# Altium schematic sheet eth_ksz8567r_switch.SchDoc
size C
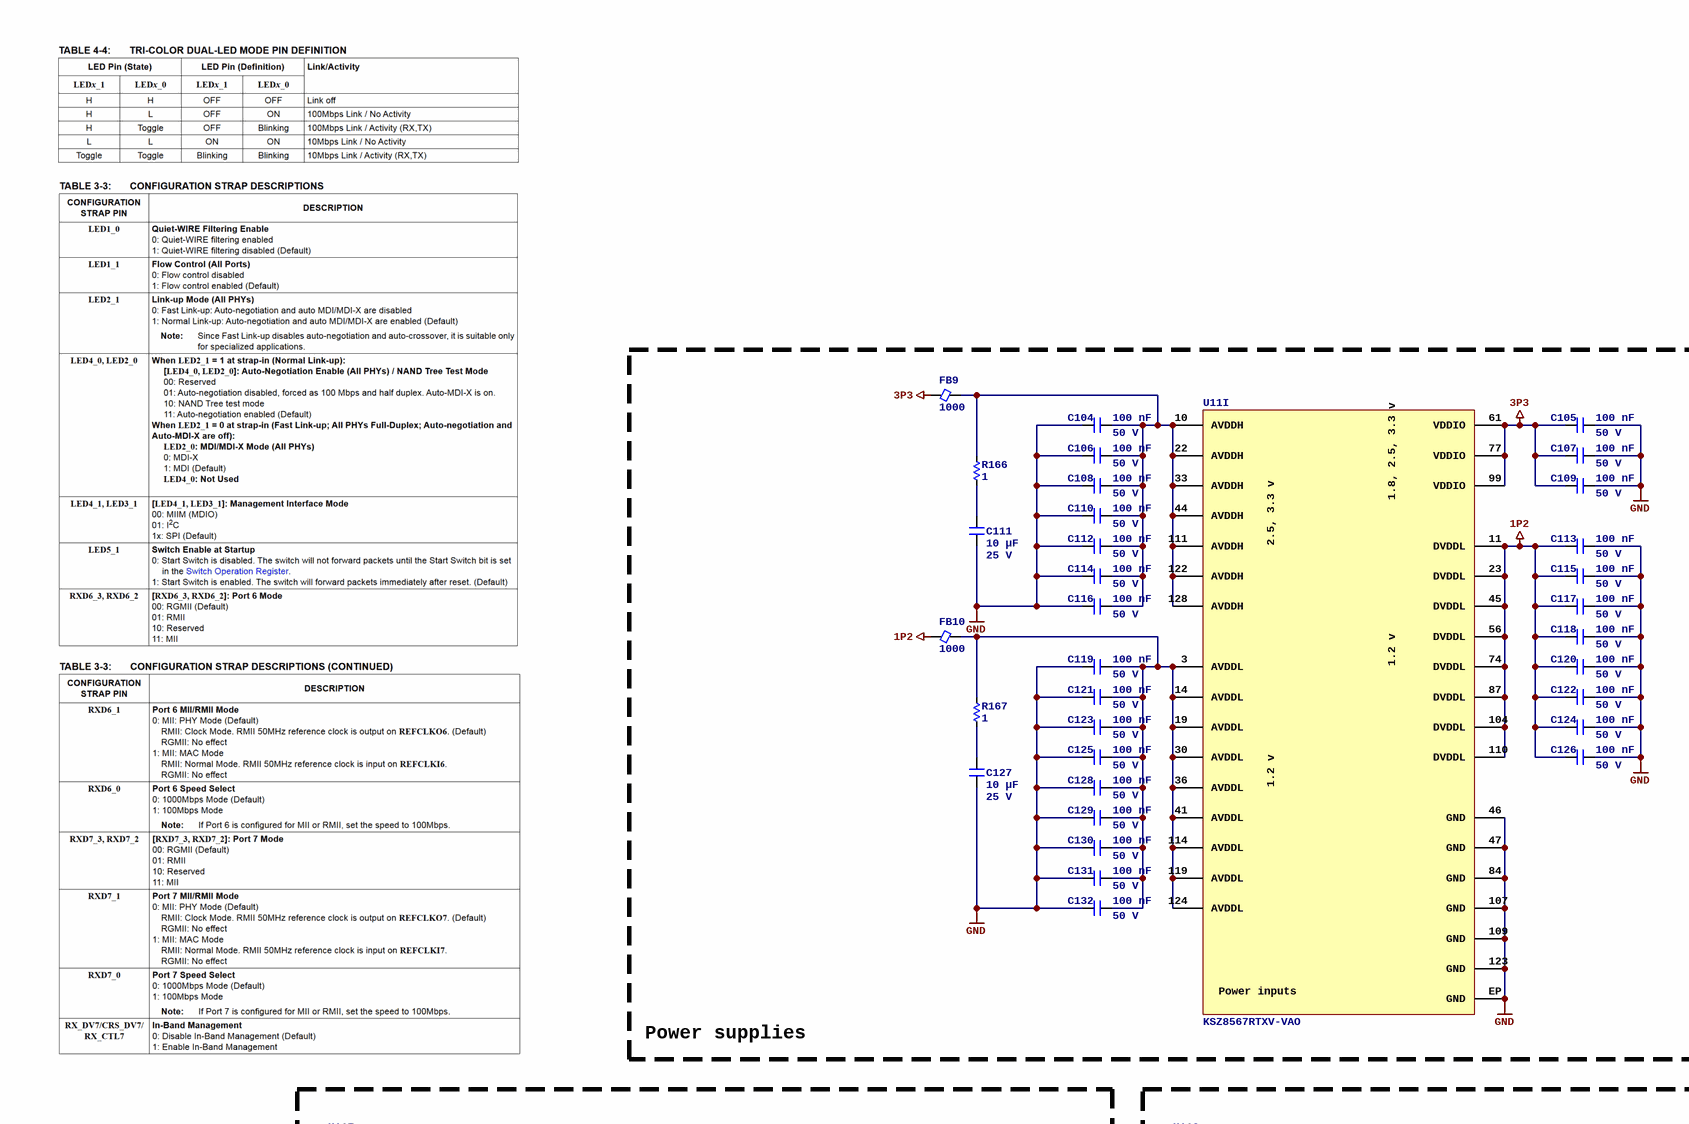
[diagram p0: eth_ksz8567r_switch.SchDoc, top left]
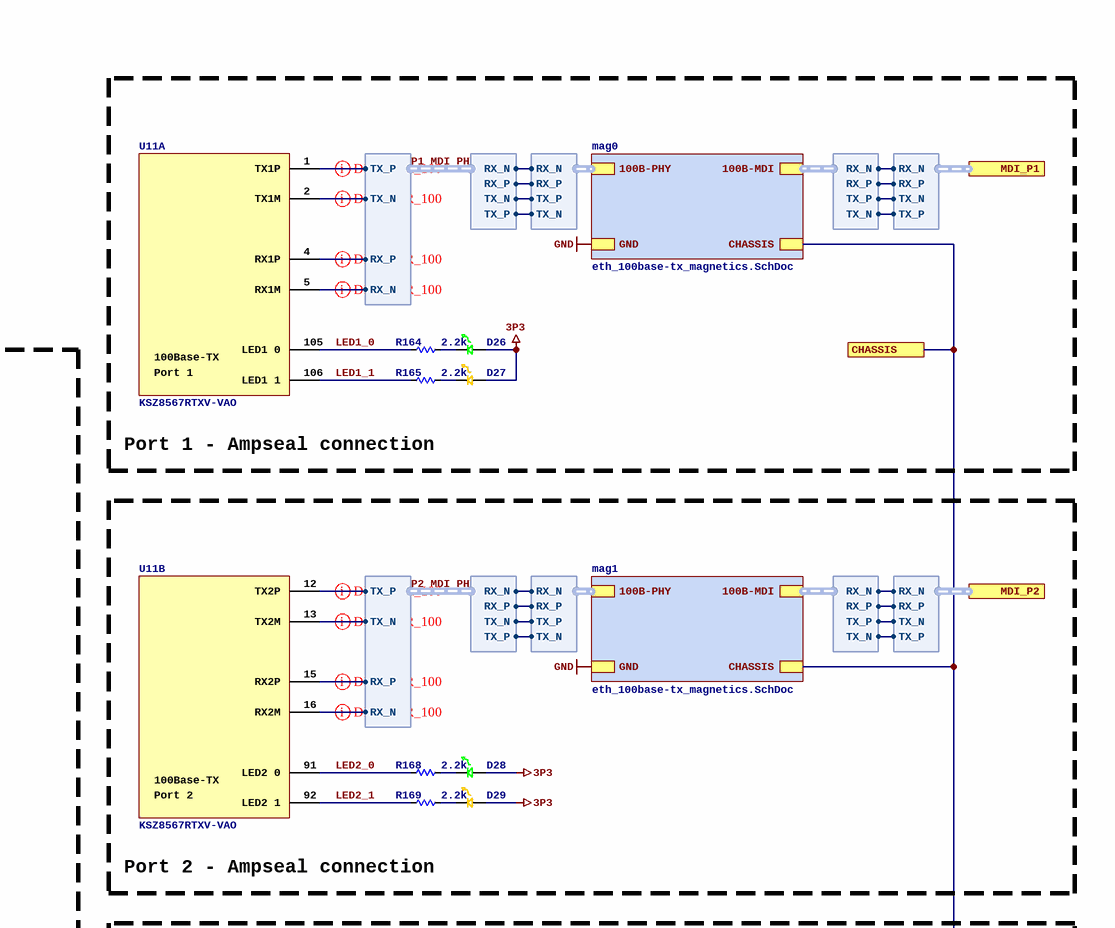
[diagram p1: eth_ksz8567r_switch.SchDoc, top right]
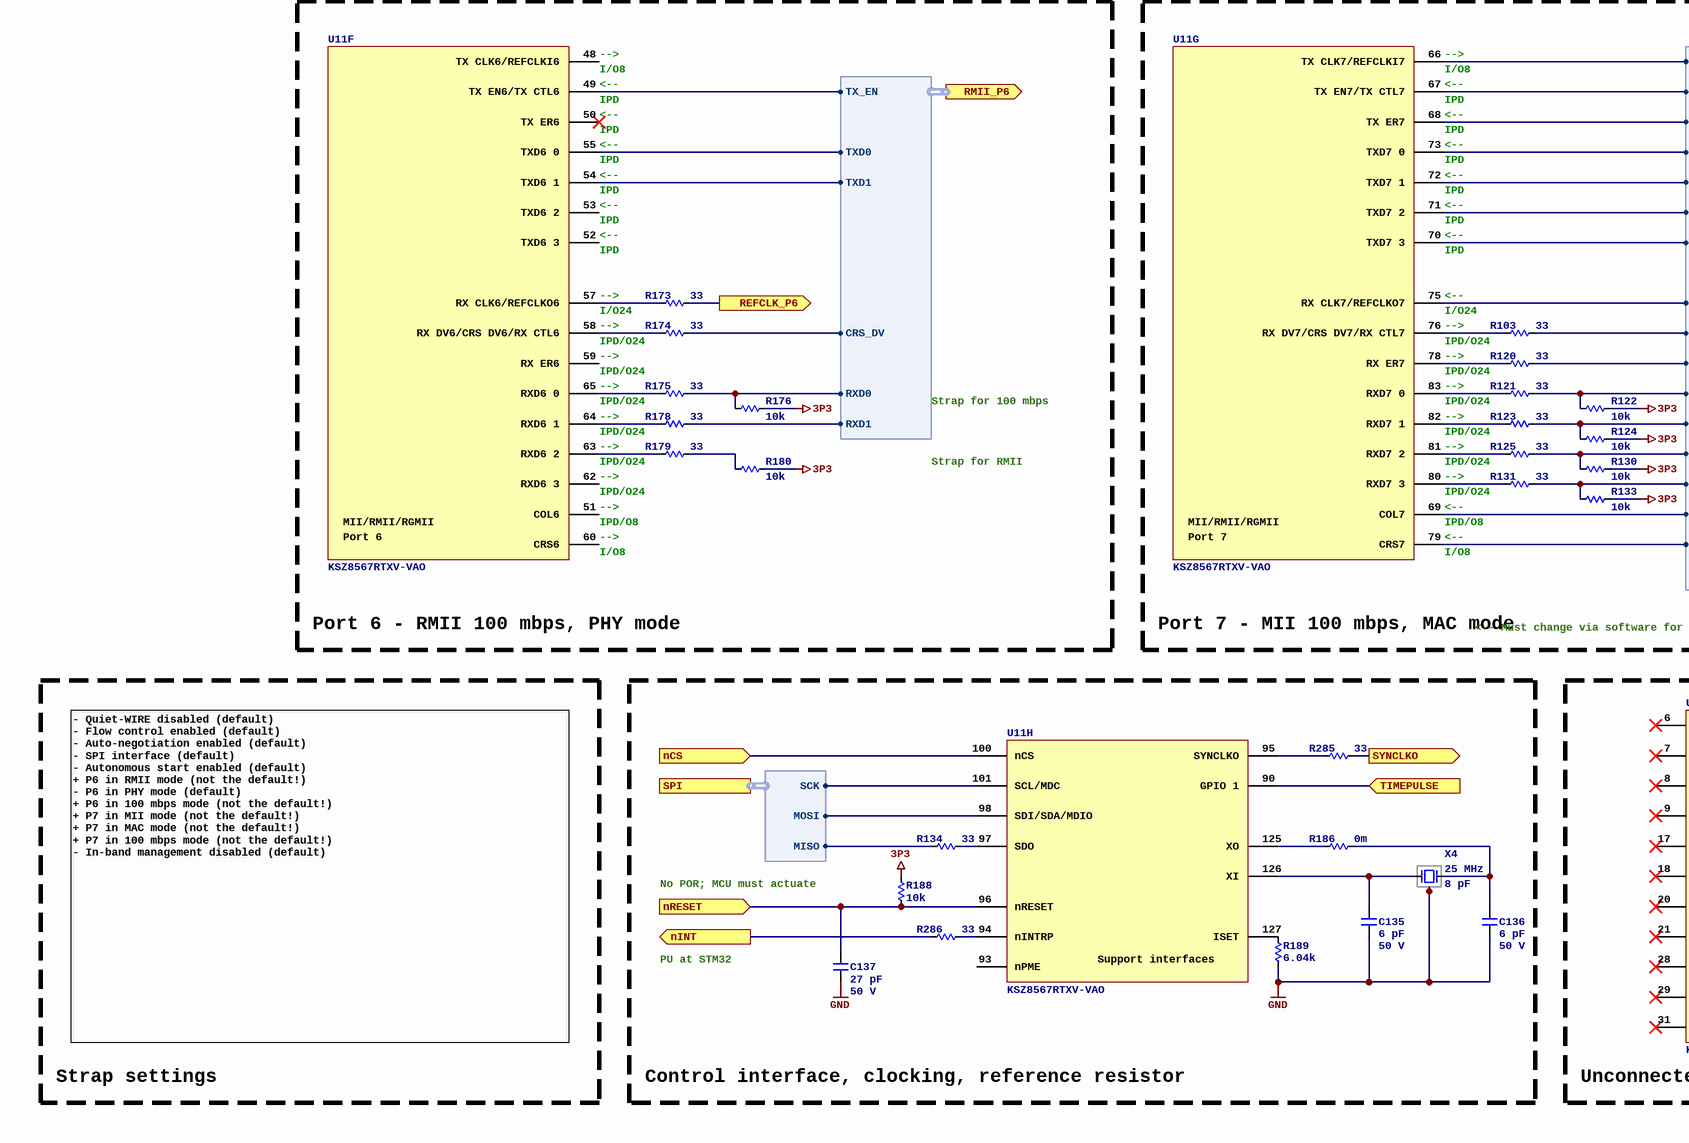
[diagram p2: eth_ksz8567r_switch.SchDoc, bottom left]
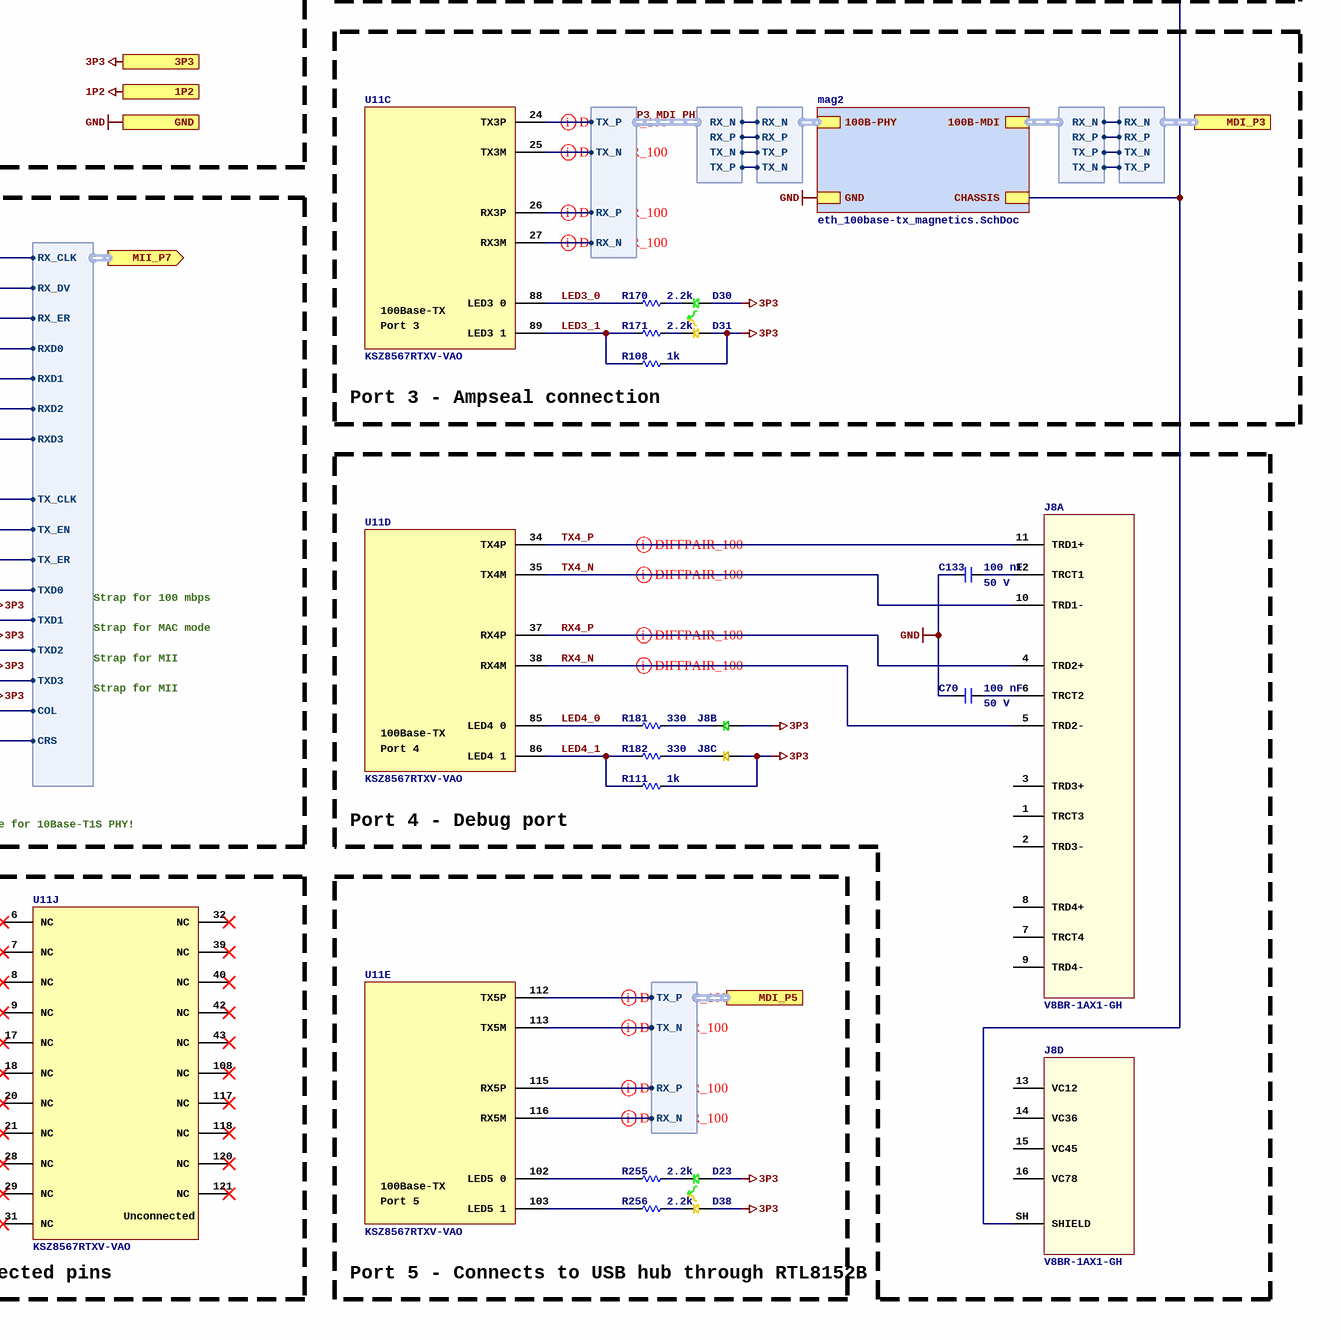
[diagram p3: eth_ksz8567r_switch.SchDoc, bottom right]

## Parts
C70  Capacitance: 100 nF  Voltage Rating: 50 V  [C0402]  (hidden comment: CL05B104KB54PNC)
C104  Capacitance: 100 nF  Voltage Rating: 50 V  [C0402]  (hidden comment: CL05B104KB54PNC)
C105  Capacitance: 100 nF  Voltage Rating: 50 V  [C0402]  (hidden comment: CL05B104KB54PNC)
C106  Capacitance: 100 nF  Voltage Rating: 50 V  [C0402]  (hidden comment: CL05B104KB54PNC)
C107  Capacitance: 100 nF  Voltage Rating: 50 V  [C0402]  (hidden comment: CL05B104KB54PNC)
C108  Capacitance: 100 nF  Voltage Rating: 50 V  [C0402]  (hidden comment: CL05B104KB54PNC)
C109  Capacitance: 100 nF  Voltage Rating: 50 V  [C0402]  (hidden comment: CL05B104KB54PNC)
C110  Capacitance: 100 nF  Voltage Rating: 50 V  [C0402]  (hidden comment: CL05B104KB54PNC)
C111  Capacitance: 10 µF  Voltage Rating: 25 V  [C0805]  (hidden comment: CL21B106KAYQNNE)
C112  Capacitance: 100 nF  Voltage Rating: 50 V  [C0402]  (hidden comment: CL05B104KB54PNC)
C113  Capacitance: 100 nF  Voltage Rating: 50 V  [C0402]  (hidden comment: CL05B104KB54PNC)
C114  Capacitance: 100 nF  Voltage Rating: 50 V  [C0402]  (hidden comment: CL05B104KB54PNC)
C115  Capacitance: 100 nF  Voltage Rating: 50 V  [C0402]  (hidden comment: CL05B104KB54PNC)
C116  Capacitance: 100 nF  Voltage Rating: 50 V  [C0402]  (hidden comment: CL05B104KB54PNC)
C117  Capacitance: 100 nF  Voltage Rating: 50 V  [C0402]  (hidden comment: CL05B104KB54PNC)
C118  Capacitance: 100 nF  Voltage Rating: 50 V  [C0402]  (hidden comment: CL05B104KB54PNC)
C119  Capacitance: 100 nF  Voltage Rating: 50 V  [C0402]  (hidden comment: CL05B104KB54PNC)
C120  Capacitance: 100 nF  Voltage Rating: 50 V  [C0402]  (hidden comment: CL05B104KB54PNC)
C121  Capacitance: 100 nF  Voltage Rating: 50 V  [C0402]  (hidden comment: CL05B104KB54PNC)
C122  Capacitance: 100 nF  Voltage Rating: 50 V  [C0402]  (hidden comment: CL05B104KB54PNC)
C123  Capacitance: 100 nF  Voltage Rating: 50 V  [C0402]  (hidden comment: CL05B104KB54PNC)
C124  Capacitance: 100 nF  Voltage Rating: 50 V  [C0402]  (hidden comment: CL05B104KB54PNC)
C125  Capacitance: 100 nF  Voltage Rating: 50 V  [C0402]  (hidden comment: CL05B104KB54PNC)
C126  Capacitance: 100 nF  Voltage Rating: 50 V  [C0402]  (hidden comment: CL05B104KB54PNC)
C127  Capacitance: 10 µF  Voltage Rating: 25 V  [C0805]  (hidden comment: CL21B106KAYQNNE)
C128  Capacitance: 100 nF  Voltage Rating: 50 V  [C0402]  (hidden comment: CL05B104KB54PNC)
C129  Capacitance: 100 nF  Voltage Rating: 50 V  [C0402]  (hidden comment: CL05B104KB54PNC)
C130  Capacitance: 100 nF  Voltage Rating: 50 V  [C0402]  (hidden comment: CL05B104KB54PNC)
C131  Capacitance: 100 nF  Voltage Rating: 50 V  [C0402]  (hidden comment: CL05B104KB54PNC)
C132  Capacitance: 100 nF  Voltage Rating: 50 V  [C0402]  (hidden comment: CL05B104KB54PNC)
C133  Capacitance: 100 nF  Voltage Rating: 50 V  [C0402]  (hidden comment: CL05B104KB54PNC)
C135  Capacitance: 6 pF  Voltage Rating: 50 V  [C0402]  (hidden comment: 0402CG6R0C500NT)
C136  Capacitance: 6 pF  Voltage Rating: 50 V  [C0402]  (hidden comment: 0402CG6R0C500NT)
C137  Capacitance: 27 pF  Voltage Rating: 50 V  [C0402]  (hidden comment: 0402CG270J500NT)
D23  LTST-C190GKT  [LED_0603P_GREEN]  (value not drawn)
D26  LTST-C190GKT  [LED_0603P_GREEN]  (value not drawn)
D27  LTST-C190AKT  [LED_0603P_AMBER]  (value not drawn)
D28  LTST-C190GKT  [LED_0603P_GREEN]  (value not drawn)
D29  LTST-C190AKT  [LED_0603P_AMBER]  (value not drawn)
D30  LTST-C190GKT  [LED_0603P_GREEN]  (value not drawn)
D31  LTST-C190AKT  [LED_0603P_AMBER]  (value not drawn)
D38  LTST-C190AKT  [LED_0603P_AMBER]  (value not drawn)
FB9  Current Rating (mA): 1000  [FB0805]  (hidden comment: MGGB2012M600HT-LF)
FB10  Current Rating (mA): 1000  [FB0805]  (hidden comment: MGGB2012M600HT-LF)
J8  V8BR-1AX1-GH  [BELFUSE_V8BR-1AX1-GH]  (parts A,B,C,D of 4)
R103  value 33  [R0402]  (hidden comment: 0402WGF330JTCE)
R108  value 1k  [R0402]  (hidden comment: 0402WGF1001TCE)
R111  value 1k  [R0402]  (hidden comment: 0402WGF1001TCE)
R120  value 33  [R0402]  (hidden comment: 0402WGF330JTCE)
R121  value 33  [R0402]  (hidden comment: 0402WGF330JTCE)
R122  value 10k  [R0402]  (hidden comment: 0402WGF1002TCE)
R123  value 33  [R0402]  (hidden comment: 0402WGF330JTCE)
R124  value 10k  [R0402]  (hidden comment: 0402WGF1002TCE)
R125  value 33  [R0402]  (hidden comment: 0402WGF330JTCE)
R130  value 10k  [R0402]  (hidden comment: 0402WGF1002TCE)
R131  value 33  [R0402]  (hidden comment: 0402WGF330JTCE)
R133  value 10k  [R0402]  (hidden comment: 0402WGF1002TCE)
R134  value 33  [R0402]  (hidden comment: 0402WGF330JTCE)
R164  value 2.2k  [R0402]  (hidden comment: 0402WGF2201TCE)
R165  value 2.2k  [R0402]  (hidden comment: 0402WGF2201TCE)
R166  value 1  [R0402]  (hidden comment: CRCW04021R00FKED)
R167  value 1  [R0402]  (hidden comment: CRCW04021R00FKED)
R168  value 2.2k  [R0402]  (hidden comment: 0402WGF2201TCE)
R169  value 2.2k  [R0402]  (hidden comment: 0402WGF2201TCE)
R170  value 2.2k  [R0402]  (hidden comment: 0402WGF2201TCE)
R171  value 2.2k  [R0402]  (hidden comment: 0402WGF2201TCE)
R173  value 33  [R0402]  (hidden comment: 0402WGF330JTCE)
R174  value 33  [R0402]  (hidden comment: 0402WGF330JTCE)
R175  value 33  [R0402]  (hidden comment: 0402WGF330JTCE)
R176  value 10k  [R0402]  (hidden comment: 0402WGF1002TCE)
R178  value 33  [R0402]  (hidden comment: 0402WGF330JTCE)
R179  value 33  [R0402]  (hidden comment: 0402WGF330JTCE)
R180  value 10k  [R0402]  (hidden comment: 0402WGF1002TCE)
R181  value 330  [R0402]  (hidden comment: 0402WGF3300TCE)
R182  value 330  [R0402]  (hidden comment: 0402WGF3300TCE)
R186  value 0m  [R0402]  (hidden comment: 0402WGF0000TCE)
R188  value 10k  [R0402]  (hidden comment: 0402WGF1002TCE)
R189  value 6.04k  [R0402]  (hidden comment: 0402WGF6041TCE)
R255  value 2.2k  [R0402]  (hidden comment: 0402WGF2201TCE)
R256  value 2.2k  [R0402]  (hidden comment: 0402WGF2201TCE)
R285  value 33  [R0402]  (hidden comment: 0402WGF330JTCE)
R286  value 33  [R0402]  (hidden comment: 0402WGF330JTCE)
U11  KSZ8567RTXV-VAO  [MICROCHIP_C04-418B_128TQFP_14X14_10X10EP]  (parts A,B,C,D,E,F,G,H,I,J of 10)
X4  Frequency: 25 MHz  Capacitance: 8 pF  [4_SMD_2.0X1.6MM]  (hidden comment: ABM11W-25.0000MHZ-8-D1X-T3)

## Blocks framed on the sheet
Port 1 - Ampseal connection: D26 D27 R164 R165 U11
Power supplies: C104-C132 FB9 FB10 R166 R167 U11
Port 2 - Ampseal connection: D28 D29 R168 R169 U11
Port 3 - Ampseal connection: D30 D31 R108 R170 R171 U11
Port 6 - RMII 100 mbps, PHY mode: R173-R176 R178-R180 U11
Port 7 - MII 100 mbps, MAC mode: R103 R120-R125 R130 R131 R133 U11
Port 4 - Debug port: C70 C133 J8 R111 R181 R182 U11
Control interface, clocking, reference resistor: C135-C137 R134 R186 R188 R189 R285 R286 U11 X4
Unconnected pins: U11
Port 5 - Connects to USB hub through RTL8152B: D23 D38 R255 R256 U11

## Sub-sheets
mag0 = eth_100base-tx_magnetics.SchDoc: 100B-PHY (harness 100BASE-TX), GND, CHASSIS, 100B-MDI (harness 100BASE-TX)
mag1 = eth_100base-tx_magnetics.SchDoc: 100B-PHY (harness 100BASE-TX), GND, CHASSIS, 100B-MDI (harness 100BASE-TX)
mag2 = eth_100base-tx_magnetics.SchDoc: 100B-PHY (harness 100BASE-TX), GND, CHASSIS, 100B-MDI (harness 100BASE-TX)

## Ports
1P2, 3P3, CHASSIS, GND, MDI_P1 (harness 100BASE-TX), MDI_P2 (harness 100BASE-TX), MDI_P3 (harness 100BASE-TX), MDI_P5 (harness 100BASE-TX), MII_P7 (out, harness MII), nCS (in), nINT (out), nRESET (in), REFCLK_P6 (out), RMII_P6 (out, harness RMII), SPI (harness SPI), SYNCLKO (out), TIMEPULSE (in)

## Harnesses
100BASE-TX: RX_N, RX_P, TX_N, TX_P
RMII: CRS_DV, RXD0, RXD1, TX_EN, TXD0, TXD1
MII: RXD0, RXD1, TX_EN, TXD0, TXD1, RXD2, RXD3, TXD2, TXD3, TX_ER, TX_CLK, CRS, COL, RX_ER, RX_DV, RX_CLK
SPI: MISO, MOSI, SCK
100BASE-TX: TX_N, RX_N, RX_P, TX_P
100BASE-TX: TX_P, RX_N, TX_N, RX_P
100BASE-TX: TX_N, RX_N, TX_P, RX_P
100BASE-TX: TX_N, TX_P, RX_N, RX_P
100BASE-TX: RX_N, RX_P, TX_P, TX_N

## Nets
1P2: C113.1 C115.1 C117.1 C118.1 C120.1 C122.1 C124.1 C126.1 FB10.1 U11.11(DVDDL) U11.23(DVDDL) U11.45(DVDDL) U11.56(DVDDL) U11.74(DVDDL) U11.87(DVDDL) U11.104(DVDDL) U11.110(DVDDL) ; port 1P2
3P3: C105.1 C107.1 C109.1 D23.1 D26.1 D27.1 D28.1 D29.1 D30.1 D31.1 D38.1 FB9.1 J8.18 J8.20 R108.1 R111.1 R122.1 R124.1 R130.1 R133.1 R176.1 R180.1 R188.1 U11.61(VDDIO) U11.77(VDDIO) U11.99(VDDIO) ; port 3P3
GND: C70.2 C104.2 C105.2 C106.2 C107.2 C108.2 C109.2 C110.2 C111.2 C112.2 C113.2 C114.2 C115.2 C116.2 C117.2 C118.2 C119.2 C120.2 C121.2 C122.2 C123.2 C124.2 C125.2 C126.2 C127.2 C128.2 C129.2 C130.2 C131.2 C132.2 C133.2 C135.2 C136.2 C137.2 R189.2 U11.46(GND) U11.47(GND) U11.84(GND) U11.107(GND) U11.109(GND) U11.123(GND) U11.EP(GND) X4.2 X4.4 ; port GND, sheet mag0/GND, sheet mag1/GND, sheet mag2/GND
CHASSIS: J8.SH(SHIELD) ; port CHASSIS, sheet mag0/CHASSIS, sheet mag1/CHASSIS, sheet mag2/CHASSIS
LED1_0: R164.2 U11.105(LED1_0)
LED1_1: R165.2 U11.106(LED1_1)
LED2_0: R168.2 U11.91(LED2_0)
LED2_1: R169.2 U11.92(LED2_1)
LED3_0: R170.2 U11.88(LED3_0)
LED3_1: R108.2 R171.2 U11.89(LED3_1)
LED4_0: R181.1 U11.85(LED4_0)
LED4_1: R111.2 R182.1 U11.86(LED4_1)
nCS: U11.100(nCS) ; port nCS
nINT: R286.2 ; port nINT
nRESET: C137.1 R188.2 U11.96(nRESET) ; port nRESET
P1_MDI_PHY.RX_N: U11.5(RX1M) ; harness 100BASE-TX.RX_N, sheet mag0/100B-PHY.RX_N
P1_MDI_PHY.RX_P: U11.4(RX1P) ; harness 100BASE-TX.RX_P, sheet mag0/100B-PHY.RX_P
P1_MDI_PHY.TX_N: U11.2(TX1M) ; harness 100BASE-TX.TX_N, sheet mag0/100B-PHY.TX_P
P1_MDI_PHY.TX_P: U11.1(TX1P) ; harness 100BASE-TX.TX_P, sheet mag0/100B-PHY.TX_N
P2_MDI_PHY.RX_N: U11.16(RX2M) ; harness 100BASE-TX.RX_N, sheet mag1/100B-PHY.RX_N
P2_MDI_PHY.RX_P: U11.15(RX2P) ; harness 100BASE-TX.RX_P, sheet mag1/100B-PHY.RX_P
P2_MDI_PHY.TX_N: U11.13(TX2M) ; harness 100BASE-TX.TX_N, sheet mag1/100B-PHY.TX_P
P2_MDI_PHY.TX_P: U11.12(TX2P) ; harness 100BASE-TX.TX_P, sheet mag1/100B-PHY.TX_N
P3_MDI_PHY.RX_N: U11.27(RX3M) ; harness 100BASE-TX.RX_N, sheet mag2/100B-PHY.RX_N
P3_MDI_PHY.RX_P: U11.26(RX3P) ; harness 100BASE-TX.RX_P, sheet mag2/100B-PHY.RX_P
P3_MDI_PHY.TX_N: U11.25(TX3M) ; harness 100BASE-TX.TX_N, sheet mag2/100B-PHY.TX_P
P3_MDI_PHY.TX_P: U11.24(TX3P) ; harness 100BASE-TX.TX_P, sheet mag2/100B-PHY.TX_N
REFCLK_P6: R173.1 ; port REFCLK_P6
RX4_N: J8.5(TRD2-) U11.38(RX4M)
RX4_P: J8.4(TRD2+) U11.37(RX4P)
SYNCLKO: R285.1 ; port SYNCLKO
TIMEPULSE: U11.90(GPIO_1) ; port TIMEPULSE
TX4_N: J8.10(TRD1-) U11.35(TX4M)
TX4_P: J8.11(TRD1+) U11.34(TX4P)
NetC70_1: C70.1 J8.6(TRCT2)
NetC104_1: C104.1 C106.1 C108.1 C110.1 C112.1 C114.1 C116.1 FB9.2 R166.2 U11.10(AVDDH) U11.22(AVDDH) U11.33(AVDDH) U11.44(AVDDH) U11.111(AVDDH) U11.122(AVDDH) U11.128(AVDDH)
NetC111_1: C111.1 R166.1
NetC119_1: C119.1 C121.1 C123.1 C125.1 C128.1 C129.1 C130.1 C131.1 C132.1 FB10.2 R167.2 U11.3(AVDDL) U11.14(AVDDL) U11.19(AVDDL) U11.30(AVDDL) U11.36(AVDDL) U11.41(AVDDL) U11.114(AVDDL) U11.119(AVDDL) U11.124(AVDDL)
NetC127_1: C127.1 R167.1
NetC133_1: C133.1 J8.12(TRCT1)
NetC135_1: C135.1 U11.126(XI) X4.1
NetC136_1: C136.1 R186.2 X4.3
NetD23_2: D23.2 R255.1
NetD26_2: D26.2 R164.1
NetD27_2: D27.2 R165.1
NetD28_2: D28.2 R168.1
NetD29_2: D29.2 R169.1
NetD30_2: D30.2 R170.1
NetD31_2: D31.2 R171.1
NetD38_2: D38.2 R256.1
NetJ8_17: J8.17 R182.2
NetJ8_19: J8.19 R181.2
NetR103_1: R103.1 ; port MII_P7.TX_EN
NetR103_2: R103.2 U11.76(RX_DV7/CRS_DV7/RX_CTL7)
NetR120_1: R120.1 ; port MII_P7.TX_ER
NetR120_2: R120.2 U11.78(RX_ER7)
NetR121_1: R121.1 R122.2 ; port MII_P7.TXD0
NetR121_2: R121.2 U11.83(RXD7_0)
NetR123_1: R123.1 R124.2 ; port MII_P7.TXD1
NetR123_2: R123.2 U11.82(RXD7_1)
NetR125_1: R125.1 R130.2 ; port MII_P7.TXD2
NetR125_2: R125.2 U11.81(RXD7_2)
NetR131_1: R131.1 R133.2 ; port MII_P7.TXD3
NetR131_2: R131.2 U11.80(RXD7_3)
NetR134_1: R134.1 U11.97(SDO)
NetR134_2: R134.2 ; port SPI.MISO
NetR173_2: R173.2 U11.57(RX_CLK6/REFCLKO6)
NetR174_1: R174.1 ; port RMII_P6.CRS_DV
NetR174_2: R174.2 U11.58(RX_DV6/CRS_DV6/RX_CTL6)
NetR175_1: R175.1 R176.2 ; port RMII_P6.RXD0
NetR175_2: R175.2 U11.65(RXD6_0)
NetR178_1: R178.1 ; port RMII_P6.RXD1
NetR178_2: R178.2 U11.64(RXD6_1)
NetR179_1: R179.1 R180.2
NetR179_2: R179.2 U11.63(RXD6_2)
NetR186_1: R186.1 U11.125(XO)
NetR189_1: R189.1 U11.127(ISET)
NetR255_2: R255.2 U11.102(LED5_0)
NetR256_2: R256.2 U11.103(LED5_1)
NetR285_2: R285.2 U11.95(SYNCLKO)
NetR286_1: R286.1 U11.94(nINTRP)
NetU11_49: U11.49(TX_EN6/TX_CTL6) ; port RMII_P6.TX_EN
NetU11_54: U11.54(TXD6_1) ; port RMII_P6.TXD1
NetU11_55: U11.55(TXD6_0) ; port RMII_P6.TXD0
NetU11_66: U11.66(TX_CLK7/REFCLKI7) ; port MII_P7.RX_CLK
NetU11_67: U11.67(TX_EN7/TX_CTL7) ; port MII_P7.RX_DV
NetU11_68: U11.68(TX_ER7) ; port MII_P7.RX_ER
NetU11_69: U11.69(COL7) ; port MII_P7.COL
NetU11_70: U11.70(TXD7_3) ; port MII_P7.RXD3
NetU11_71: U11.71(TXD7_2) ; port MII_P7.RXD2
NetU11_72: U11.72(TXD7_1) ; port MII_P7.RXD1
NetU11_73: U11.73(TXD7_0) ; port MII_P7.RXD0
NetU11_75: U11.75(RX_CLK7/REFCLKO7) ; port MII_P7.TX_CLK
NetU11_79: U11.79(CRS7) ; port MII_P7.CRS
NetU11_98: U11.98(SDI/SDA/MDIO) ; port SPI.MOSI
NetU11_101: U11.101(SCL/MDC) ; port SPI.SCK
NetU11_112: U11.112(TX5P) ; port MDI_P5.TX_P
NetU11_113: U11.113(TX5M) ; port MDI_P5.TX_N
NetU11_115: U11.115(RX5P) ; port MDI_P5.RX_P
NetU11_116: U11.116(RX5M) ; port MDI_P5.RX_N
(unnamed): port MDI_P3.TX_N, sheet mag2/100B-MDI.TX_P
(unnamed): port MDI_P3.RX_N, sheet mag2/100B-MDI.RX_N
(unnamed): port MDI_P3.RX_P, sheet mag2/100B-MDI.RX_P
(unnamed): port MDI_P3.TX_P, sheet mag2/100B-MDI.TX_N
(unnamed): port MDI_P2.TX_N, sheet mag1/100B-MDI.TX_P
(unnamed): port MDI_P2.RX_N, sheet mag1/100B-MDI.RX_N
(unnamed): port MDI_P2.RX_P, sheet mag1/100B-MDI.RX_P
(unnamed): port MDI_P2.TX_P, sheet mag1/100B-MDI.TX_N
(unnamed): port MDI_P1.TX_N, sheet mag0/100B-MDI.TX_P
(unnamed): port MDI_P1.RX_N, sheet mag0/100B-MDI.RX_N
(unnamed): port MDI_P1.RX_P, sheet mag0/100B-MDI.RX_P
(unnamed): port MDI_P1.TX_P, sheet mag0/100B-MDI.TX_N

Not connected (* = marked no-connect by the designer): J8 1(TRCT3) 2(TRD3-) 3(TRD3+) 7(TRCT4) 8(TRD4+) 9(TRD4-) 13(VC12) 14(VC36) 15(VC45) 16(VC78); U11 6(NC)* 7(NC)* 8(NC)* 9(NC)* 17(NC)* 18(NC)* 20(NC)* 21(NC)* 28(NC)* 29(NC)* 31(NC)* 32(NC)* 39(NC)* 40(NC)* 42(NC)* 43(NC)* 48(TX_CLK6/REFCLKI6) 50(TX_ER6)* 51(COL6) 52(TXD6_3) 53(TXD6_2) 59(RX_ER6) 60(CRS6) 62(RXD6_3) 93(nPME) 108(NC)* 117(NC)* 118(NC)* 120(NC)* 121(NC)*

## Layout directives
differential pair; differential pair class DE_100: NetU11_112, NetU11_113, NetU11_115, NetU11_116, P1_MDI_PHY.RX_N, P1_MDI_PHY.RX_P, P1_MDI_PHY.TX_N, P1_MDI_PHY.TX_P, P2_MDI_PHY.RX_N, P2_MDI_PHY.RX_P, P2_MDI_PHY.TX_N, P2_MDI_PHY.TX_P, P3_MDI_PHY.RX_N, P3_MDI_PHY.RX_P, P3_MDI_PHY.TX_N, P3_MDI_PHY.TX_P, RX4_N, RX4_P, TX4_N, TX4_P

## Notes on the sheet
- (near U11) -->
- (near U11) I/O8
- (near U11) <--
- (near U11) IPD
- I/O24
- IPD/O24
- Strap for 100 mbps
- Strap for MAC mode
- (near U11) IPD/O8
- Strap for RMII
- IPD/O8
- Strap for MII
- <-- Must change via software for 10Base-T1S PHY!
- No POR; MCU must actuate
- PU at STM32
- - Quiet-WIRE disabled (default)
  - Flow control enabled (default)
  - Auto-negotiation enabled (default)
  - SPI interface (default)
  - Autonomous start enabled (default)
  + P6 in RMII mode (not the default!)
  - P6 in PHY mode (default)
  + P6 in 100 mbps mode (not the default!)
  + P7 in MII mode (not the default!)
  + P7 in MAC mode (not the default!)
  + P7 in 100 mbps mode (not the default!)
  - In-band management disabled (default)
- Strap settings
- (in symbol KSZ8567RTXV-VAO, part A) 100Base-TX; Port 1
- (in symbol KSZ8567RTXV-VAO, part B) 100Base-TX; Port 2
- (in symbol KSZ8567RTXV-VAO, part C) 100Base-TX; Port 3
- (in symbol KSZ8567RTXV-VAO, part D) 100Base-TX; Port 4
- (in symbol KSZ8567RTXV-VAO, part E) 100Base-TX; Port 5
- (in symbol KSZ8567RTXV-VAO, part F) MII/RMII/RGMII; Port 6
- (in symbol KSZ8567RTXV-VAO, part G) MII/RMII/RGMII; Port 7
- (in symbol KSZ8567RTXV-VAO, part H) Support interfaces
- (in symbol KSZ8567RTXV-VAO, part I) 1.8, 2.5, 3.3 v; 2.5, 3.3 v; 1.2 v; Power inputs
- (in symbol KSZ8567RTXV-VAO, part J) Unconnected

## Library data of the parts
C70 C104-C110 C112-C126 C128-C133 = CL05B104KB54PNC: Manufacturer: Samsung Electro-Mechanics; Dielectric: X7R; ComponentLink1URL: https://wmsc.lcsc.com/wmsc/upload/file/pdf/v2/lcsc/2304140030_Samsung-Electro-Mechanics-CL05B104KB54PNC_C307331.pdf; ComponentLink1Description: Datasheet; Manufacturer Part Number: CL05B104KB54PNC; Package: 0402; Supplier 2: LCSC; Supplier Part Number 2: C307331
C111 C127 = CL21B106KAYQNNE: Manufacturer: Samsung Electro-Mechanics; Dielectric: X7R; ComponentLink1URL: https://datasheet.lcsc.com/lcsc/2206222030_Samsung-Electro-Mechanics-CL21B106KAYQNNE_C3039694.pdf; ComponentLink1Description: Datasheet; Manufacturer Part Number: CL21B106KAYQNNE; Package: 0805; Supplier 2: LCSC; Supplier Part Number 2: C3039694
C135 C136 = 0402CG6R0C500NT: Manufacturer: FH(Guangdong Fenghua Advanced Tech); Dielectric: C0G; ComponentLink1URL: https://wmsc.lcsc.com/wmsc/upload/file/pdf/v2/lcsc/2304140030_FH--Guangdong-Fenghua-Advanced-Tech-0402CG6R0C500NT_C1575.pdf; ComponentLink1Description: Datasheet; Manufacturer Part Number: 0402CG6R0C500NT; Package: 0402; Supplier 2: LCSC; Supplier Part Number 2: C1575
C137 = 0402CG270J500NT: Manufacturer: FH(Guangdong Fenghua Advanced Tech); Dielectric: C0G; ComponentLink1URL: https://wmsc.lcsc.com/wmsc/upload/file/pdf/v2/lcsc/2304140030_FH--Guangdong-Fenghua-Advanced-Tech-0402CG270J500NT_C1557.pdf; ComponentLink1Description: Datasheet; Manufacturer Part Number: 0402CG270J500NT; Package: 0402; Supplier 2: LCSC; Supplier Part Number 2: C1557
D23 D26 D28 D30 = LTST-C190GKT: LED GREEN CLEAR 0603 SMD; Manufacturer: Lite-On Inc; Vf: 2.0 V; If: 20 mA; Supplier 1: DigiKey; ComponentLink1URL: https://mm.digikey.com/Volume0/opasdata/d220001/medias/docus/858/LTST-C190GKT.pdf; ComponentLink1Description: Datasheet; Supplier Part Number 1: 160-1183-1-ND; Manufacturer Part Number: LTST-C190GKT; Supplier 2: LCSC; Supplier Part Number 2: C125093; LED Color: Green; Supplier 3: Mouser; Supplier Part Number 3: 859-LTST-C190GKT
D27 D29 D31 D38 = LTST-C190AKT: LED AMBER CLEAR 0603 SMD; Manufacturer: Lite-On Inc; Vf: 2.1 V; If: 20 mA; Supplier 1: DigiKey; ComponentLink1URL: https://mm.digikey.com/Volume0/opasdata/d220001/medias/docus/1139/LTST-C190AKT.pdf; ComponentLink1Description: Datasheet; Supplier Part Number 1: 160-1180-1-ND; Manufacturer Part Number: LTST-C190AKT; Supplier 2: LCSC; Supplier Part Number 2: C6085129; LED Color: Amber; Supplier 3: Mouser; Supplier Part Number 3: 859-LTST-C190AKT
FB9 FB10 = MGGB2012M600HT-LF: Manufacturer: microgate; Z @ 100 MHz: 60; DCR (mOhms): 50; ComponentLink1URL: https://wmsc.lcsc.com/wmsc/upload/file/pdf/v2/lcsc/2304140030_microgate-MGGB2012M600HT-LF_C281169.pdf; ComponentLink1Description: Datasheet; Manufacturer Part Number: MGGB2012M600HT-LF; Supplier 2: LCSC; Supplier Part Number 2: C281169; Package: 0805
J8 = V8BR-1AX1-GH: Conn RJ-45 F 8 POS 1.02mm Solder ST Thru-Hole 20 Terminal 1 Port Tray; Manufacturer: Bel; Supplier 1: DigiKey; Supplier Part Number 1: 5923-V8BR-1AX1-GH-ND; Manufacturer Part Number: V8BR-1AX1-GH; ComponentLink1URL: https://www.belfuse.com/media/drawings/products/magjack%20ICMs/dr-MAG-V8BR-1AX1-GH.pdf; ComponentLink1Description: Drawing; Supplier 2: LCSC; Supplier Part Number 2: C5346729; Supplier 3: Mouser; Supplier Part Number 3: 530-V8BR-1AX1-GH
R103 R120 R121 R123 R125 R131 R134 R173-R175 R178 R179 R285 R286 = 0402WGF330JTCE: Manufacturer: UNI-ROYAL(Uniroyal Elec); Tolerance: 1%; Temperature Coefficient: ±100ppm/?; Power Rating (mW): 62.5; ComponentLink1Description: Datasheet; ComponentLink1URL: https://wmsc.lcsc.com/wmsc/upload/file/pdf/v2/lcsc/2205311900_UNI-ROYAL-Uniroyal-Elec-0402WGF330JTCE_C25105.pdf; Manufacturer Part Number: 0402WGF330JTCE; Package: 0402; Supplier 2: LCSC; Supplier Part Number 2: C25105
R108 R111 = 0402WGF1001TCE: Manufacturer: UNI-ROYAL(Uniroyal Elec); Tolerance: 1%; Temperature Coefficient: ±100ppm/?; Power Rating (mW): 62.5; ComponentLink1Description: Datasheet; ComponentLink1URL: https://wmsc.lcsc.com/wmsc/upload/file/pdf/v2/lcsc/2206010216_UNI-ROYAL-Uniroyal-Elec-0402WGF1001TCE_C11702.pdf; Manufacturer Part Number: 0402WGF1001TCE; Package: 0402; Supplier 2: LCSC; Supplier Part Number 2: C11702
R122 R124 R130 R133 R176 R180 R188 = 0402WGF1002TCE: Manufacturer: UNI-ROYAL(Uniroyal Elec); Tolerance: 1%; Temperature Coefficient: ±100ppm/?; Power Rating (mW): 62.5; ComponentLink1Description: Datasheet; ComponentLink1URL: https://wmsc.lcsc.com/wmsc/upload/file/pdf/v2/lcsc/2206010100_UNI-ROYAL-Uniroyal-Elec-0402WGF1002TCE_C25744.pdf; Manufacturer Part Number: 0402WGF1002TCE; Package: 0402; Supplier 2: LCSC; Supplier Part Number 2: C25744
R164 R165 R168-R171 R255 R256 = 0402WGF2201TCE: Manufacturer: UNI-ROYAL(Uniroyal Elec); Tolerance: 1%; Temperature Coefficient: ±100ppm/?; Power Rating (mW): 62.5; ComponentLink1Description: Datasheet; ComponentLink1URL: https://wmsc.lcsc.com/wmsc/upload/file/pdf/v2/lcsc/2206010045_UNI-ROYAL-Uniroyal-Elec-0402WGF2201TCE_C25879.pdf; Manufacturer Part Number: 0402WGF2201TCE; Package: 0402; Supplier 2: LCSC; Supplier Part Number 2: C25879
R166 R167 = CRCW04021R00FKED: Manufacturer: Vishay Intertech; Tolerance: 1%; Temperature Coefficient: ±100ppm/?; Power Rating (mW): 63; ComponentLink1Description: Datasheet; ComponentLink1URL: https://wmsc.lcsc.com/wmsc/upload/file/pdf/v2/lcsc/2211030200_Vishay-Intertech-CRCW04021R00FKED_C482087.pdf; Manufacturer Part Number: CRCW04021R00FKED; Package: 0402; Supplier 2: LCSC; Supplier Part Number 2: C482087
R181 R182 = 0402WGF3300TCE: Manufacturer: UNI-ROYAL(Uniroyal Elec); Tolerance: 1%; Temperature Coefficient: ±100ppm/?; Power Rating (mW): 62.5; ComponentLink1Description: Datasheet; ComponentLink1URL: https://wmsc.lcsc.com/wmsc/upload/file/pdf/v2/lcsc/2205311900_UNI-ROYAL-Uniroyal-Elec-0402WGF3300TCE_C25104.pdf; Manufacturer Part Number: 0402WGF3300TCE; Package: 0402; Supplier 2: LCSC; Supplier Part Number 2: C25104
R186 = 0402WGF0000TCE: Manufacturer: UNI-ROYAL(Uniroyal Elec); Power Rating (mW): 62.5; ComponentLink1Description: Datasheet; ComponentLink1URL: https://wmsc.lcsc.com/wmsc/upload/file/pdf/v2/lcsc/2206010216_UNI-ROYAL-Uniroyal-Elec-0402WGF0000TCE_C17168.pdf; Manufacturer Part Number: 0402WGF0000TCE; Package: 0402; Supplier 2: LCSC; Supplier Part Number 2: C17168
R189 = 0402WGF6041TCE: Manufacturer: UNI-ROYAL(Uniroyal Elec); Tolerance: 1%; Temperature Coefficient: ±100ppm/?; Power Rating (mW): 62.5; ComponentLink1Description: Datasheet; ComponentLink1URL: https://wmsc.lcsc.com/wmsc/upload/file/pdf/v2/lcsc/2206010045_UNI-ROYAL-Uniroyal-Elec-0402WGF6041TCE_C25913.pdf; Manufacturer Part Number: 0402WGF6041TCE; Package: 0402; Supplier 2: LCSC; Supplier Part Number 2: C25913
U11 = KSZ8567RTXV-VAO: Automotive Ethernet Switch 7 Port 10Mbps/100Mbps 128-Pin TQFP EP Tray; Manufacturer: Microchip; Manufacturer Part Number: KSZ8567RTXV-VAO; ComponentLink1Description: Datasheet; ComponentLink1URL: https://ww1.microchip.com/downloads/aemDocuments/documents/UNG/ProductDocuments/DataSheets/KSZ8567R-Data-Sheet-DS00002328.pdf; Supplier 3: microchipDIRECT; Supplier Part Number 3: KSZ8567RTXV-VAO
X4 = ABM11W-25.0000MHZ-8-D1X-T3: 25 MHz ±10ppm Crystal 8pF 50 Ohms 4-SMD, No Lead; Manufacturer: Abracon LLC; Supplier 1: DigiKey; Supplier Part Number 1: 535-13853-1-ND; Manufacturer Part Number: ABM11W-25.0000MHZ-8-D1X-T3; ComponentLink1Description: Datasheet; ComponentLink1URL: https://abracon.com/Resonators/ABM11W.pdf; Supplier 2: LCSC; Supplier Part Number 2: C1985767; Supplier 3: Mouser; Supplier Part Number 3: 815-11W25-8D1XT